# Altium schematic sheet isoGPIO.SchDoc
size A4; CompanyName: Technische Hochschule Nürnberg Georg Simon Ohm; Organization: UltraZohm; Address1: Kesslerplatz 12; Address2: 90489 Nürnberg; Address3: GERMANY; SheetNumber: 18; SheetTotal: 36; Website: www.ultrazohm.com
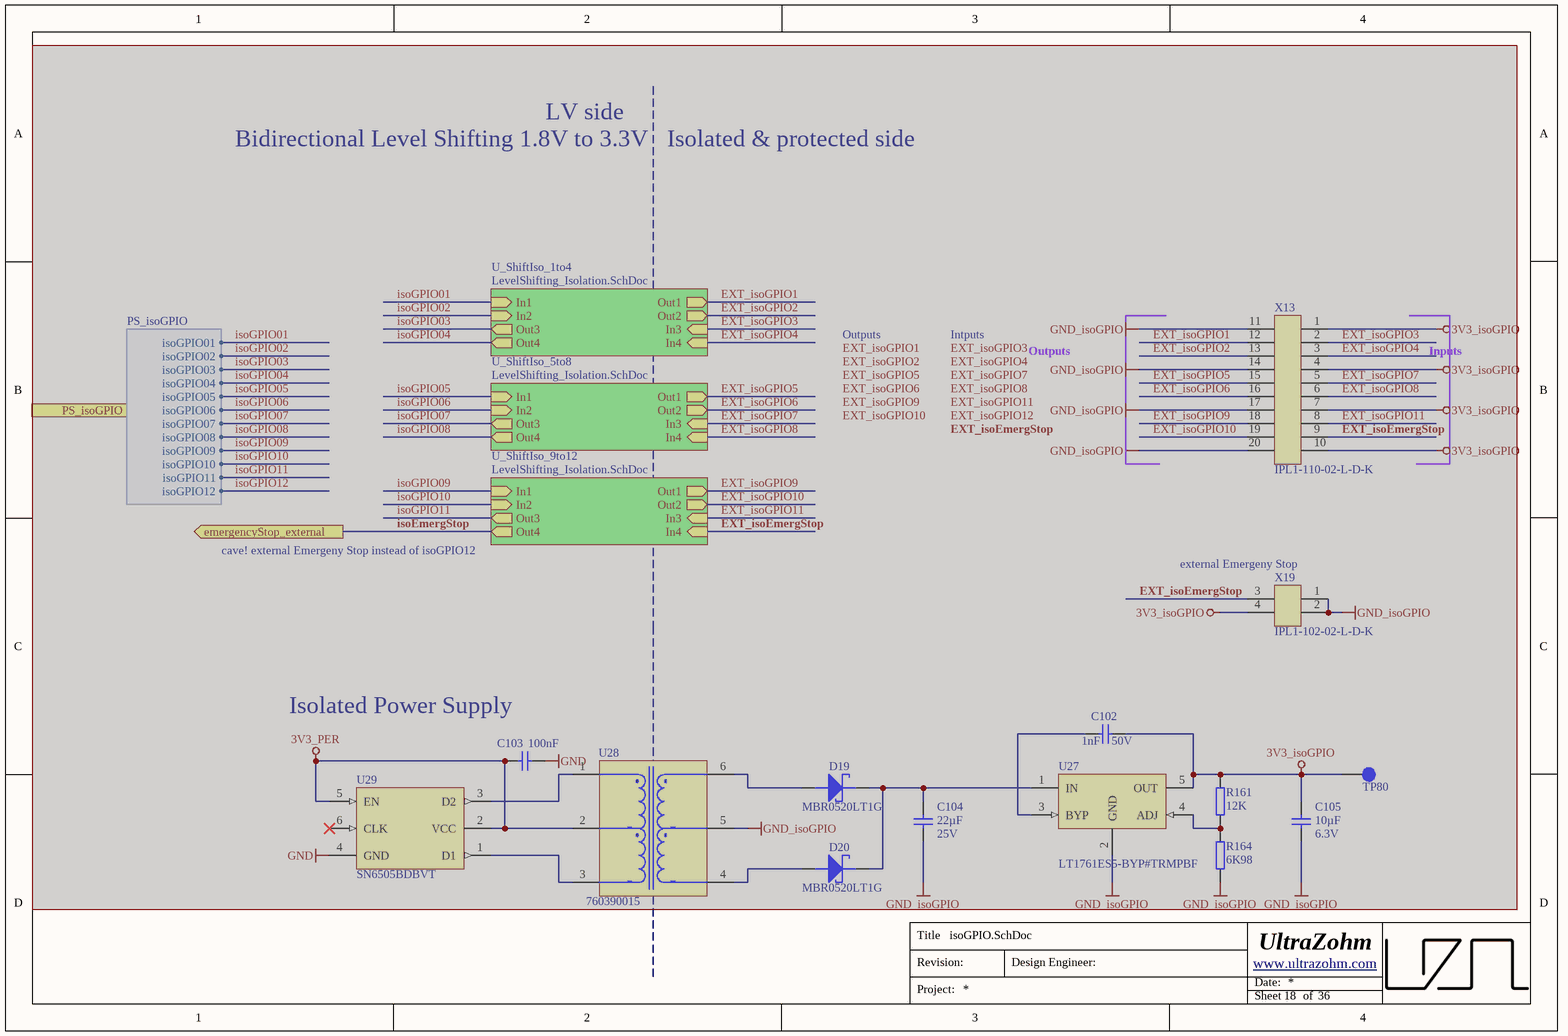
[diagram p0: isoGPIO.SchDoc]

## Parts
C102  1nF  Voltage: 50V  [CAPC1608X90N_V]  (masked out: inside a compile mask, not in the netlist)
C103  100nF  [CAPC1608X90N_V]  (masked out: inside a compile mask, not in the netlist)
C104  22µF  Voltage: 25V  [CAPC2012X135N_V]  (masked out: inside a compile mask, not in the netlist)
C105  10µF  Voltage: 6.3V  [CAPC1608X90N_V]  (masked out: inside a compile mask, not in the netlist)
D19  MBR0520LT1G  [SOD3816X120N]  (masked out: inside a compile mask, not in the netlist)
D20  MBR0520LT1G  [SOD3816X120N]  (masked out: inside a compile mask, not in the netlist)
R161  12K  [RESC1608X55N_V]  (masked out: inside a compile mask, not in the netlist)
R164  6K98  [RESC1608X55N_V]  (masked out: inside a compile mask, not in the netlist)
TP80  Testpoint 1mm  [TP_1mm]  (value not drawn)  (masked out: inside a compile mask, not in the netlist)
U27  LT1761ES5-BYP#TRMPBF  [SOT23-5_N]  (masked out: inside a compile mask, not in the netlist)
U28  760390015  [760390015]  (masked out: inside a compile mask, not in the netlist)
U29  SN6505BDBVT  [SOT95P280X145-6N]  (masked out: inside a compile mask, not in the netlist)
X13  IPL1-110-02-L-D-K  [IPL1-110-02-L-D-K]  (masked out: inside a compile mask, not in the netlist)
X19  IPL1-102-02-L-D-K  [IPL1-102-02-L-D-K]  (masked out: inside a compile mask, not in the netlist)

## Sub-sheets
U_ShiftIso_1to4 = LevelShifting_Isolation.SchDoc (masked out): In1 (in), In2 (in), In3 (in), In4 (in), Out1 (out), Out2 (out), Out4 (out), Out3 (out)
U_ShiftIso_5to8 = LevelShifting_Isolation.SchDoc (masked out): In1 (in), In2 (in), In3 (in), In4 (in), Out1 (out), Out2 (out), Out4 (out), Out3 (out)
U_ShiftIso_9to12 = LevelShifting_Isolation.SchDoc (masked out): In1 (in), In2 (in), In3 (in), In4 (in), Out1 (out), Out2 (out), Out4 (out), Out3 (out)

## Ports
emergencyStop_external (out), PS_isoGPIO (harness PS_isoGPIO)

## Harnesses
PS_isoGPIO: isoGPIO01, isoGPIO02, isoGPIO03, isoGPIO05, isoGPIO04, isoGPIO07, isoGPIO08, isoGPIO09, isoGPIO06, isoGPIO10, isoGPIO11, isoGPIO12

## Notes on the sheet
- Bidirectional Level Shifting 1.8V to 3.3V
- LV side
- Isolated & protected side
- Outputs
- Intputs
- Inputs
- cave! external Emergeny Stop instead of isoGPIO12
- (near X19) external Emergeny Stop
- (near C103) Isolated Power Supply
- Title
- Revision:
- Design Engineer:
- Date:
- Project:
- Sheet
- of

## Library data of the parts
C102 = 22523: KON 1nF 50V NP0 5% SMD BF 1608 (0603); Value: 1n; AN: 22523; Mixed: SMT; Technology: NP0; Case: 1608 (0603)
C103 = 21382: KON 100nF 50V X7R ±10% SMD BF 1608 (0603); Value: 100n; AN: 21382; Mixed: SMT; Preferred: Yes; Temperature-Range: -55/+125; Tolerance: ±10%; Voltage: 50V; Technology: X7R; Case: 1608 (0603)
C104 = 29556: KON 22µF 25V  X5R 20% SMD BF 2012 (0805); Value: 22u; AN: 29556; Mixed: SMT; Temperature-Range: -55/+85; Technology: X5R; Case: 2012 (0805); Tolerance: 20%
C105 = 22918: KON 10µF 6,3V X5R SMD BF 1608 (0603); Value: 10u; AN: 22918; Mixed: SMT; Temperature-Range: -55/+85; Technology: X5R; Case: 1608 (0603)
D19 D20 = 26768: Schottky Diode 0.5A 20V SOD-123; AN: 26768; Mixed: SMT; Extra: AEC−Q101; Value: 20V; Case: SOD123-FC; Voltage: 0.5A; HelpURL: B:\AD\adlib\datasheet\MBR0520; H-ART: MBR0520LT1G
R161 = 22655: WID SMD 12K 1% 0,1W; AN: 22655; Mixed: SMT; Extra: BF 1608 (0603); Tolerance: 1%; Case: 1608 (0603); Technology: TK100; Value: 12K
R164 = 26473: WID SMD 6K98 1% 0,1W  BF 1608 (0603); AN: 26473; Mixed: SMT; Value: 6.98k; Preferred: Yes; Tolerance: 1%; Case: 1608 (0603); Technology: TK100
TP80 = 25063: AN: 25063; Mixed: SMT
U27 = LT1761ES5-BYP#TRMPBF: 100mA, Low Noise, LDO Micropower Regulators; belongs to SN74AVC4T774RSVR; Manufacturer: Linear Technology; Created from: MGremer; Manufacturer Part Number: LT1761ES5-BYP#TRMPBF; PartID: 5; Created On: 30.11.2020 13:55:34; ComponentLink1Description: Datasheet; ComponentLink1URL: https://www.analog.com/media/en/technical-documentation/data-sheets/1761sff.pdf; Component Type: LDO Micropower; Device Package: TSOT-23; Last Updated: 15.02.2021 10:27:30; Mounting Type: SMD; Supplier 1: Farnell; Supplier Part Number 1: 1663782; Type: LDO Micropower Regulator; Live Cycle Status: 1; Stock number: not stored
U28 = 30767: AN: 30767; Mixed: SMT; Temperature-Range: -40/+125; Extra: Push-Pull Transformer 1:2 0.35A; Case: MID-PPTI; HelpURL: b:\AD\adlib\datasheet\Wuerth\MID-PPTI\760390015\; H-ART: 760390015
U29 = 30768: AN: 30768; Mixed: SMT; Temperature-Range: -55/+125; Extra: 1-A Transformer Driver for Isolated Power Supplies SOT23-6; Case: SOT23-6; HelpURL: b:\AD\adlib\datasheet\TI\SN6505x\; H-ART: SN6505BDBVT; Storage-Temperature: -65/+150 (Abs)
X13 = 30765: AN: 30765; Mixed: SMT; H-ART: IPL1-110-02-L-D-K-TR; Temperature-Range: -55/+125; Extra: Connector Header IPL1, 2-row 20pos, key polarization, SMT 0°; Case: IPL1; HelpURL: b:\AD\adlib\datasheet\Samtec\IPL1-SMT\
X19 = 30759: AN: 30759; Mixed: SMT; H-ART: IPL1-102-02-L-D-K-TR; Temperature-Range: -55/+125; Extra: Connector Header IPL1, 2-row 4pos, key polarization, SMT 0°; Case: IPL1; HelpURL: b:\AD\adlib\datasheet\Samtec\IPL1-SMT\